# Altium schematic sheet LM-008.SchDoc: Main
size Tabloid; DocumentNumber: LM-008; Revision: B; SheetNumber: 1; SheetTotal: 7; DocumentName: LM-008
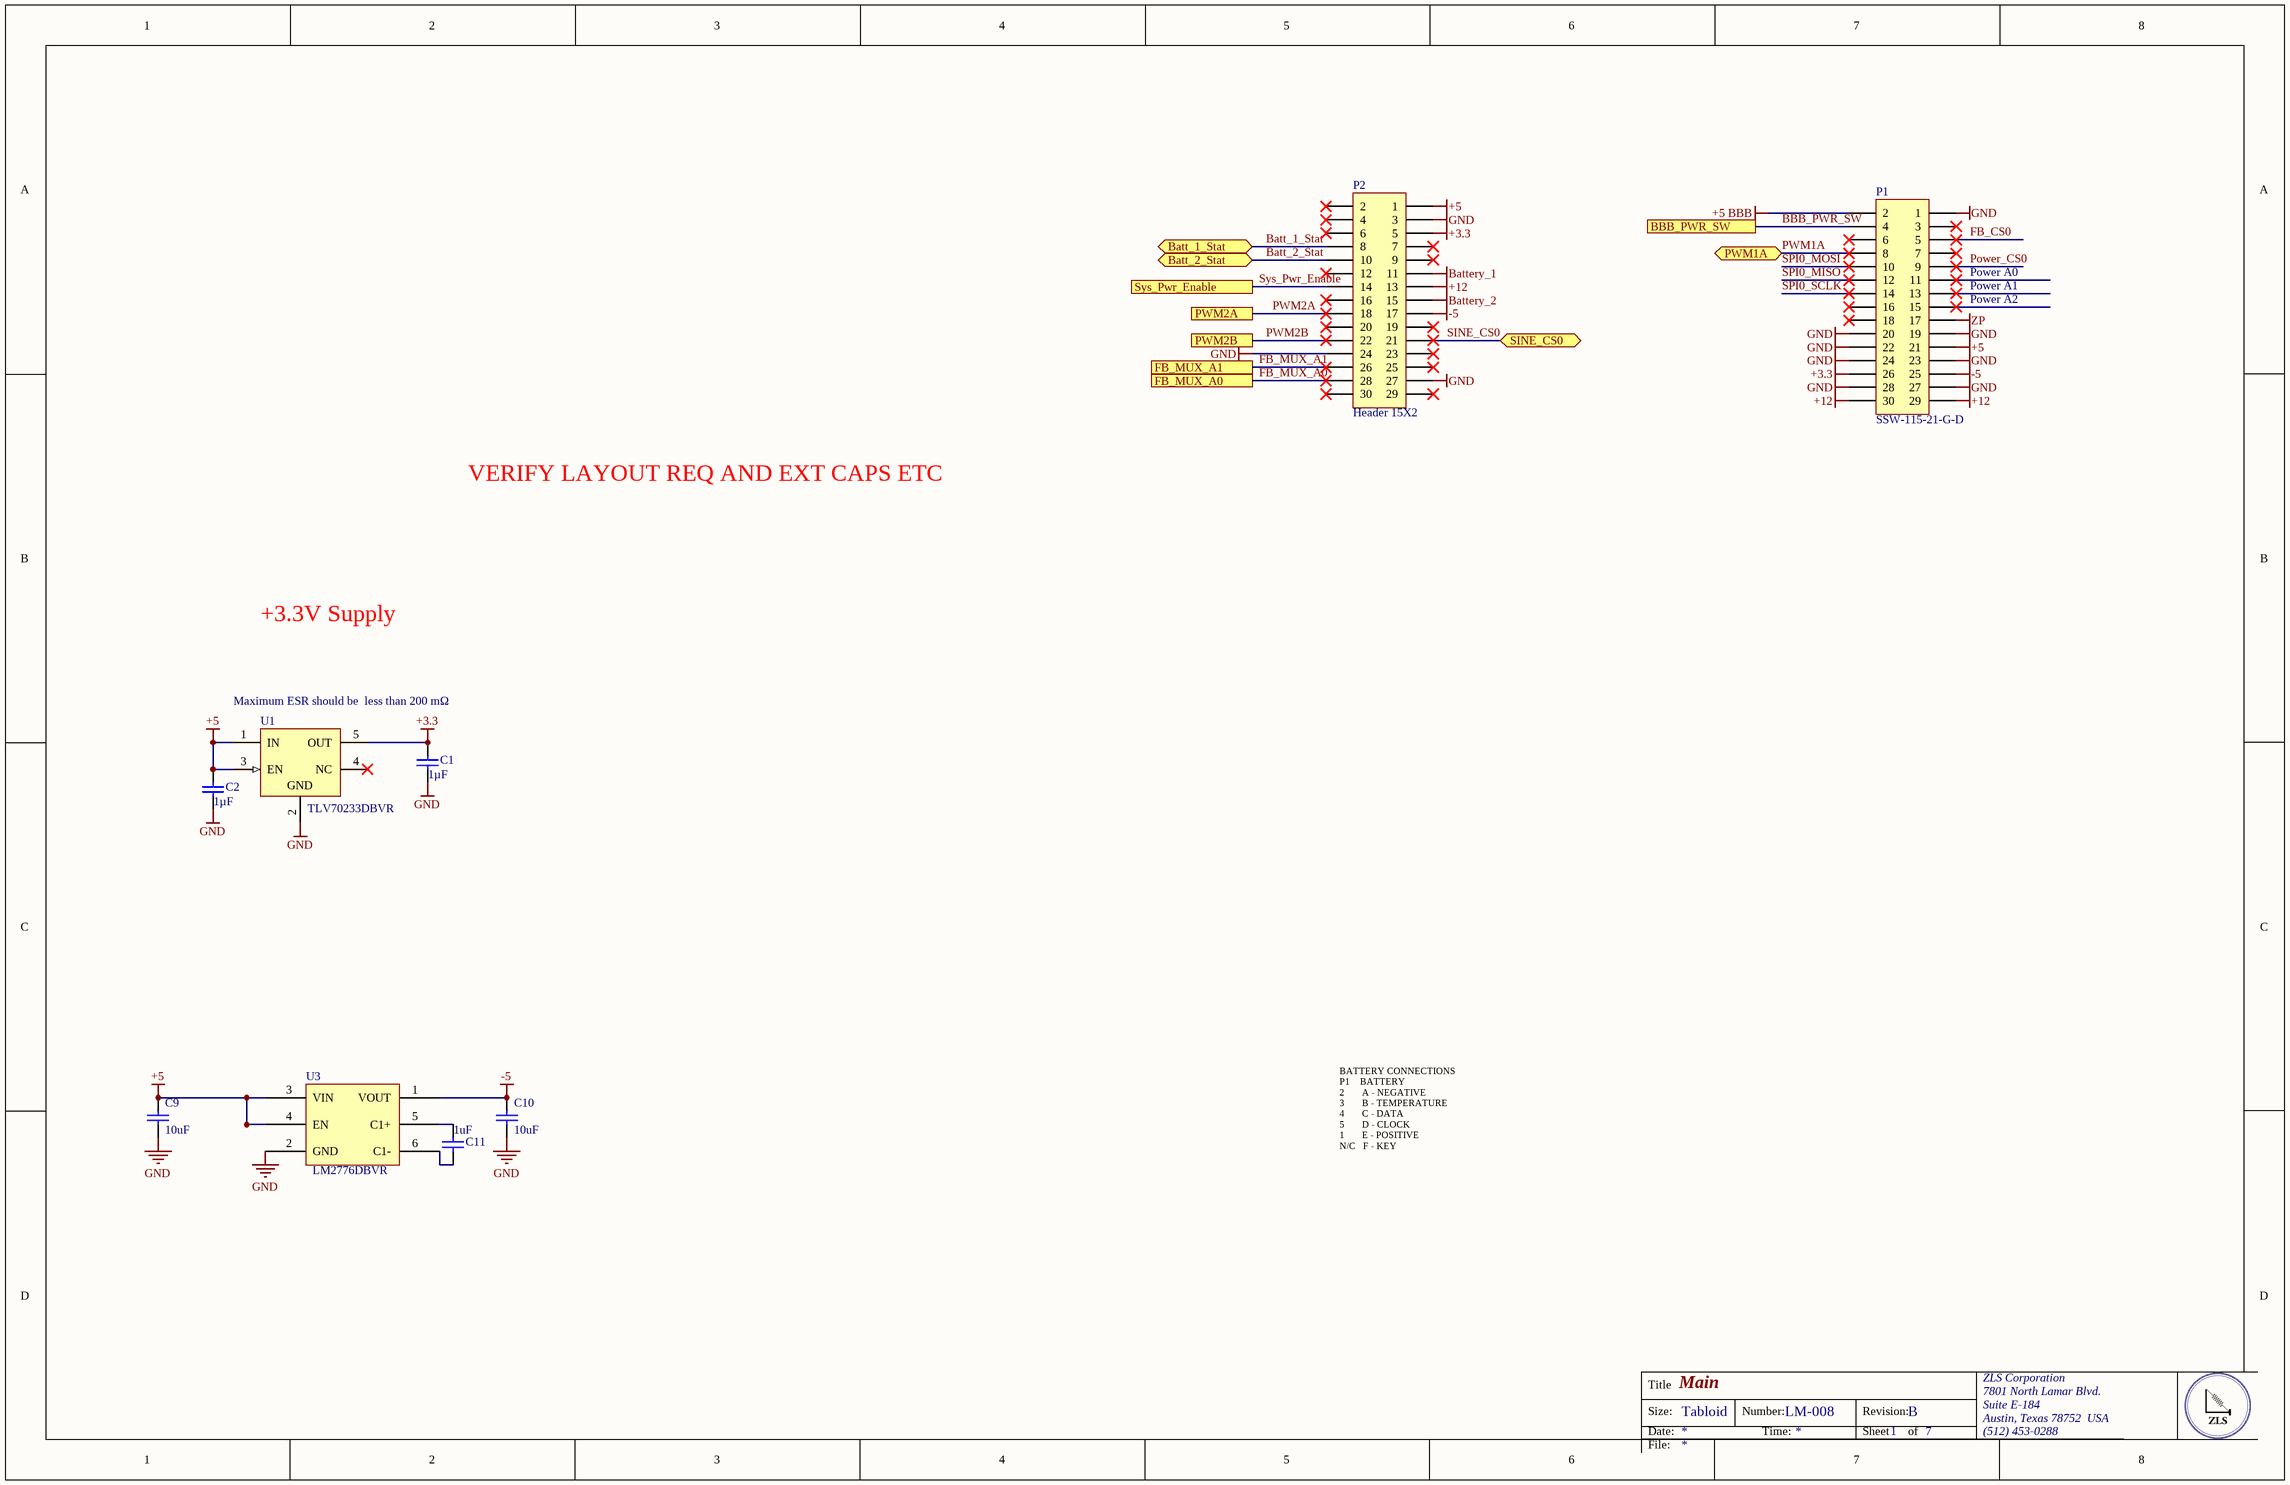
[diagram p0: LM-008.SchDoc]

## Parts
C1  Capacitance: 1µF  [CAPC1206(3216)130_N]  (hidden comment: CAP CER 1UF 50V X7R 1210)
C2  Capacitance: 1µF  [CAPC1206(3216)130_N]  (hidden comment: CAP CER 1UF 50V X7R 1210)
C9  10uF  [CAPC0805(2012)145_N]
C10  10uF  [CAPC0805(2012)145_N]
C11  1uF  [CAPC0805(2012)145_N]
P1  SSW-115-21-G-D  [HDR2X15]
P2  Header 15X2  [HDR2X15]
U1  TLV70233DBVR  [DBV0005A_N]
U3  LM2776DBVR  [LM2776DBVR]

## Ports
Batt_1_Stat, Batt_2_Stat, BBB_PWR_SW, FB_MUX_A0, FB_MUX_A1, PWM1A, PWM2A, PWM2B, SINE_CS0, Sys_Pwr_Enable

## Nets
+3.3: C1.2 P1.26 P2.5 U1.5(OUT)
+5: C2.2 C9.1 P1.21 P2.1 U1.1(IN) U1.3(EN) U3.3(VIN) U3.4(EN)
+5 BBB: P1.2
+12: P1.29 P1.30 P2.13
-5: C10.1 P1.25 P2.17 U3.1(VOUT)
Battery_1: P2.11
Battery_2: P2.15
GND: C1.1 C2.1 C9.2 C10.2 P1.1 P1.19 P1.20 P1.22 P1.23 P1.24 P1.27 P1.28 P2.3 P2.24 P2.27 U1.2(GND) U3.2(GND)
ZP: P1.17
Batt_1_Stat: P2.8 ; port Batt_1_Stat
Batt_2_Stat: P2.10 ; port Batt_2_Stat
BBB_PWR_SW: P1.4 ; port BBB_PWR_SW
FB_CS0: P1.5
FB_MUX_A0: P2.28 ; port FB_MUX_A0
FB_MUX_A1: P2.26 ; port FB_MUX_A1
Power_CS0: P1.9
PWM1A: P1.8 ; port PWM1A
PWM2A: P2.18 ; port PWM2A
PWM2B: P2.22 ; port PWM2B
SINE_CS0: P2.21 ; port SINE_CS0
SPI0_MISO: P1.12
SPI0_MOSI: P1.10
SPI0_SCLK: P1.14
Sys_Pwr_Enable: P2.14 ; port Sys_Pwr_Enable
NetC11_1: C11.1 U3.5(C1+)
NetC11_2: C11.2 U3.6(C1-)

Not connected (* = marked no-connect by the designer): P1 3* 6* 7* 11* 13* 15* 16* 18*; P2 2* 4* 6* 7* 9* 12* 16* 19* 20* 23* 25* 29* 30*; U1 4(NC)*

## Notes on the sheet
- (near P1) Power A0
- (near P1) Power A1
- (near P1) Power A2
- VERIFY LAYOUT REQ AND EXT CAPS ETC
- +3.3V Supply
- Maximum ESR should be  less than 200 mΩ
- BATTERY CONNECTIONS
  P1    BATTERY
  2       A - NEGATIVE
  3       B - TEMPERATURE
  4       C - DATA
  5       D - CLOCK
  1       E - POSITIVE
  N/C   F - KEY
- Title
- Size:
- Date:
- Tabloid
- Number:
- Time:
- Revision:
- Sheet
- of
- ZLS Corporation
- 7801 North Lamar Blvd.
- Suite E-184
- Austin, Texas 78752  USA
- (512) 453-0288
- File:

## Library data of the parts
C1 C2 = CMP-1037-04913-1: Manufacturer: Murata Electronics North America; Manufacturer Part Number: GRM32RR71H105KA01L; Tolerance: ±10%; Supplier 1: Digi-Key; Supplier Part Number 1: 490-1863-6-ND; RoHS: RoHS Compliant; Category: Capacitors; Stock 1: 66890; Pricing 1: 1=0.35, 10=0.242, 100=0.1449, 500=0.10868 (USD); Packaging: Digi-Reel®; Part Status: Active; Voltage - Rated: 50V; Temperature Coefficient: X7R; Operating Temperature: -55°C ~ 125°C; Features: -; Ratings: -; Applications: General Purpose; Mounting Type: Surface Mount, MLCC; Package / Case: 1210 (3225 Metric); Size / Dimension: 0.126" L x 0.098" W (3.20mm x 2.50mm); Height - Seated (Max): -; Thickness (Max): 0.079" (2.00mm); Lead Spacing: -; Lead Style: -; ComponentLink1URL: http://search.murata.co.jp/Ceramy/image/img/A01X/G101/ENG/GRM32RR71H105KA01-01.pdf; ComponentLink1Description: http://search.murata.co.jp/Ceramy/image/img/A01X/G101/ENG/GRM32RR71H105KA01-01.pdf
C9 C10 = CMP-1036-04795-1: CAP CER 10UF 16V X6S 0805; Manufacturer: TDK Corporation; Manufacturer Part Number: C2012X6S1C106K085AC; Tolerance: ±10%; Notification: Current market demand for these product types have resulted in fluctuating and extending lead times. Lead times may differ.; Supplier 1: Digi-Key; Supplier Part Number 1: 445-14483-6-ND; RoHS: RoHS Compliant; Category: Capacitors; Stock 1: 0; Pricing 1: 1=0.38, 10=0.259, 100=0.1466, 500=0.1035, 1000=0.09056 (USD); Packaging: Digi-Reel®; Part Status: Active; Voltage - Rated: 16V; Temperature Coefficient: X6S; Operating Temperature: -55°C ~ 105°C; Features: Low ESL; Ratings: -; Applications: General Purpose; Failure Rate: -; Mounting Type: Surface Mount, MLCC; Package / Case: 0805 (2012 Metric); Size / Dimension: 0.079" L x 0.049" W (2.00mm x 1.25mm); Height - Seated (Max): -; Thickness (Max): 0.039" (1.00mm); Lead Spacing: -; Lead Style: -; ComponentLink1URL: https://product.tdk.com/info/en/catalog/datasheets/mlcc_commercial_general_en.pdf; ComponentLink1Description: https://product.tdk.com/info/en/catalog/datasheets/mlcc_commercial_general_en.pdf
C11 = CMP-1036-04795-1: CAP CER 1UF 25V X7R 0805; Manufacturer: Yageo; Manufacturer Part Number: CC0805KKX7R6BB105; Tolerance: ±10%; Voltage - Rated: 10V; Notification: Current market demand for these product types have resulted in fluctuating and extending lead times. Lead times may differ.; Supplier 1: Digi-Key; Supplier Part Number 1: 311-1458-6-ND; RoHS: RoHS Compliant; Category: Capacitors; Stock 1: 30000; Pricing 1: 1=0.25, 10=0.168, 100=0.0852, 500=0.0583, 1000=0.05158 (USD); Packaging: Digi-Reel®; Part Status: Active; Temperature Coefficient: X7R; Operating Temperature: -55°C ~ 125°C; Features: -; Ratings: -; Applications: General Purpose; Failure Rate: -; Mounting Type: Surface Mount, MLCC; Package / Case: 0805 (2012 Metric); Size / Dimension: 0.079" L x 0.049" W (2.00mm x 1.25mm); Height - Seated (Max): -; Thickness (Max): 0.057" (1.45mm); Lead Spacing: -; Lead Style: -; ComponentLink1URL: http://www.yageo.com/documents/recent/UPY-GPHC_X7R_6.3V-to-50V_18.pdf; ComponentLink1Description: http://www.yageo.com/documents/recent/UPY-GPHC_X7R_6.3V-to-50V_18.pdf
P1 = Header 15X2: Header, 15-Pin, Dual row; Manufacturer: Samtec Inc.; Connector Type: Receptacle; Style: Board to Board or Cable; Number of Positions: 30; Number of Positions Loaded: All; Pitch - Mating: 0.100" (2.54mm); Contact Length - Post: 0.104" (2.64mm); Material Flammability Rating: UL94 V-0; Current Rating: 5.7A per Contact; Supplier 1: Digi-Key; Supplier Part Number 1: SSW-115-21-G-D-ND; Manufacturer Part Number: SSW-115-21-G-D; RoHS: RoHS Compliant; Category: Connectors, Interconnects; Stock 1: 0; Pricing 1: 1=4.78 (USD); Packaging: Bulk; Part Status: Active; Contact Type: Forked; Row Spacing - Mating: 0.100" (2.54mm); Mounting Type: Through Hole; Termination: Solder; Fastening Type: Push-Pull; Contact Finish - Mating: Gold; Contact Finish Thickness - Mating: 20.0µin (0.51µm); Insulation Color: Black; Insulation Height: 0.335" (8.51mm); Operating Temperature: -55°C ~ 125°C; Contact Finish - Post: Gold; Mated Stacking Heights: -; Ingress Protection: -; Features: -; Voltage Rating: -; Applications: -; Insulation Material: Liquid Crystal Polymer (LCP); Contact Shape: Square; Contact Material: Phosphor Bronze; Contact Finish Thickness - Post: 3.00µin (0.076µm)
P2 = Header 15X2: Header, 15-Pin, Dual row; LatestRevisionDate: 17-Jul-2002; LatestRevisionNote: Re-released for DXP Platform.; Publisher: Altium Limited
U1 = CMP-0394-00528-2: Single Output LDO, 300 mA, Fixed 3.3 V Output, 2 to 5.5 V Input, with Low IQ, 5-pin SOT-23 (DBV), -40 to 125 degC, Green (RoHS & no Sb/Br); Manufacturer: Texas Instruments; Vout Adj(Max)(V): 3.3; Vin(Max)(V): 5.5; SubFamily: Single Channel LDO; Iq(Typ)(mA): 0.03; Iout(Max)(A): 0.3; Vin(Min)(V): 2; Vdo(Typ)(mV): 220; Vout Adj(Min)(V): 3.3; Eco-Plan: Green (RoHS & no Sb/Br); PackageVersion: 4073253-4/K; ComponentLink1Description: Manufacturer URL; DatasheetVersion: SLVSAG6B; ComponentLink2Description: Datasheet; ComponentLink3URL: http://www.ti.com/litv/pdf/mpds018i; ComponentLink2URL: http://www.ti.com/general/docs/lit/getliterature.tsp?genericPartNumber=TLV70233&fileType=pdf; PackageReference: DBV0005A; ComponentLink1URL: http://www.ti.com/; Mounting Technology: Surface Mount; ComponentLink3Description: Package Specification; PackageDescription: 5-Pin Plastic Small Outline, Body 1.60 Ãƒâ€” 2.90 mm, Pitch 0.95 mm; Code_JEDEC: MO-178; Fixed Output Options(V): 3.3; PartNumber: TLV70233DBVR; Accuracy(%): 2
U3 = LM2776DBVR: IC REG SWTCHD CAP INV 6SOT23; Manufacturer: Texas Instruments; Function: Ratiometric; Output Configuration: Negative; Topology: Charge Pump; Output Type: Fixed; Number of Outputs: 1; Voltage - Input (Min): 2.7V; Voltage - Input (Max): 5.5V; Voltage - Output (Min/Fixed): -Vin; Current - Output: 200mA; Frequency - Switching: 2MHz; Synchronous Rectifier: No; Supplier 1: Digi-Key; Supplier Part Number 1: 296-43957-6-ND; Manufacturer Part Number: LM2776DBVR; RoHS: RoHS Compliant; Category: Integrated Circuits (ICs); Stock 1: 13045; Pricing 1: 1=1.05, 10=0.936, 100=0.7297, 500=0.60276, 1000=0.47586 (USD); Packaging: Digi-Reel®; Part Status: Active; Voltage - Output (Max): -; Operating Temperature: -40°C ~ 85°C (TA); Mounting Type: Surface Mount; Package / Case: SOT-23-6; Supplier Device Package: SOT-23-6; ComponentLink1URL: http://www.ti.com/lit/ds/symlink/lm2776.pdf; ComponentLink1Description: http://www.ti.com/lit/ds/symlink/lm2776.pdf